# Altium schematic sheet 02.SchDoc
size A4
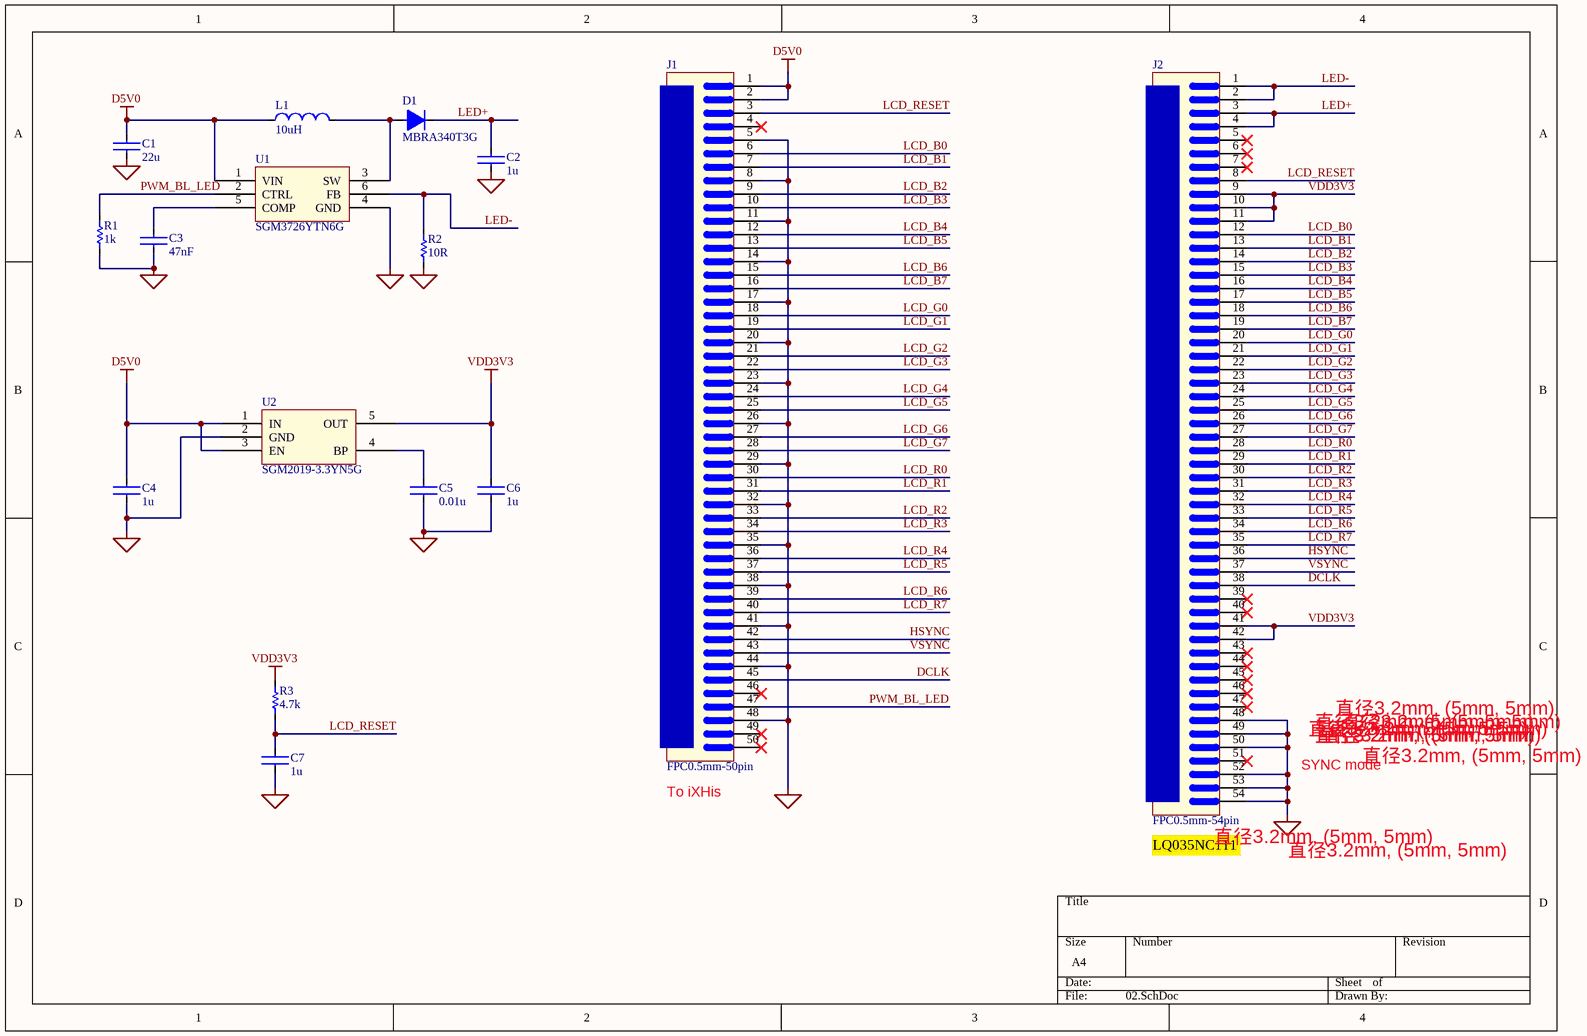
[diagram p0: 02.SchDoc]

## Parts
C1  22u  [CAPC1608X09N_C0603]
C2  1u  [CAPC2012X14N_C0805]
C3  47nF  [CAPC1608X09N_C0603]
C4  1u  [CAPC1608X09N_C0603]
C5  0.01u  [CAPC1608X09N_C0603]
C6  1u  [CAPC1608X09N_C0603]
C7  1u  [CAPC1608X09N_C0603]
D1  MBRA340T3G  [DIOM4326X23N_SMA]
J1  FPC0.5mm-50pin  [FPC0.5mm-50pin]
J2  FPC0.5mm-54pin  [FPC0.5mm-54pin]
L1  10uH  [NRS3015T100MNGH]
R1  1k  [RESC1608X05N_R0603]
R2  10R  [R0805]
R3  4.7k  [RESC1608X05N_R0603]
U1  SGM3726YTN6G  [TSOT23-6_SGM3726]
U2  SGM2019-3.3YN5G  [SOT95P280X125-5N_SGM2019]

## Nets
D5V0: C1.1 C4.1 J1.1 J1.2 L1.2 U1.1(VIN) U2.1(IN) U2.3(EN)
GND: C1.2 C2.2 C3.2 C4.2 C5.2 C6.2 C7.2 J1.5 J1.8 J1.11 J1.14 J1.17 J1.20 J1.23 J1.26 J1.29 J1.32 J1.35 J1.38 J1.41 J1.44 J1.48 J2.48 J2.49 J2.50 J2.52 J2.53 J2.54 R1.1 R2.1 U1.4(GND) U2.2(GND)
VDD3V3: C6.1 J2.9 J2.10 J2.11 J2.41 J2.42 R3.2 U2.5(OUT)
DCLK: J1.45 J2.38
HSYNC: J1.42 J2.36
LCD_B0: J1.6 J2.12
LCD_B1: J1.7 J2.13
LCD_B2: J1.9 J2.14
LCD_B3: J1.10 J2.15
LCD_B4: J1.12 J2.16
LCD_B5: J1.13 J2.17
LCD_B6: J1.15 J2.18
LCD_B7: J1.16 J2.19
LCD_G0: J1.18 J2.20
LCD_G1: J1.19 J2.21
LCD_G2: J1.21 J2.22
LCD_G3: J1.22 J2.23
LCD_G4: J1.24 J2.24
LCD_G5: J1.25 J2.25
LCD_G6: J1.27 J2.26
LCD_G7: J1.28 J2.27
LCD_R0: J1.30 J2.28
LCD_R1: J1.31 J2.29
LCD_R2: J1.33 J2.30
LCD_R3: J1.34 J2.31
LCD_R4: J1.36 J2.32
LCD_R5: J1.37 J2.33
LCD_R6: J1.39 J2.34
LCD_R7: J1.40 J2.35
LCD_RESET: C7.1 J1.3 J2.8 R3.1
LED+: C2.1 D1.2(K) J2.3 J2.4
LED-: J2.1 J2.2 R2.2 U1.6(FB)
PWM_BL_LED: J1.47 R1.2 U1.2(CTRL)
VSYNC: J1.43 J2.37
NetC3_1: C3.1 U1.5(COMP)
NetC5_1: C5.1 U2.4(BP)
NetD1_1: D1.1(A) L1.1 U1.3(SW)

Not connected (* = marked no-connect by the designer): J1 4(3)* 46* 49* 50*; J2 5(4)* 6(5)* 7(6)* 39* 40* 43* 44* 45* 46* 47* 51*

## Notes on the sheet
- 直径3.2mm, (5mm, 5mm)
- SYNC mode
- (near J1) To iXHis
- (near J2) LQ035NC111
- (near J2) 直径3.2mm, (5mm, 5mm)

## Library data of the parts
C1 = CAP114: CAP,Ceramic,X7R,10%,6.3V,22uF,0603; Manufacturer1: *; Manufacturer2: *; PartNumberManufacturer1: *; UnitPrice: *; Value: 22u
C2 = CAP110: CAP,Ceramic,X7R,10%,25V,1uF,0805; Manufacturer1: *; Manufacturer2: *; PartNumberManufacturer1: *; UnitPrice: *; Value: 1u
C3 = CAP115: CAP,Ceramic,X7R,10%,50V,47nF,0603; Manufacturer1: *; Manufacturer2: *; PartNumberManufacturer1: *; UnitPrice: *; Value: 47nF
C4 C6 C7 = CAP12: CAP,Ceramic,X7R,10%,16V,1uF,0603; Manufacturer1: *; Manufacturer2: *; PartNumberManufacturer1: *; UnitPrice: *; Value: 1u
C5 = CAP112: CAP,Ceramic,X7R,10%,50V,0.01uF,0603; Manufacturer1: *; Manufacturer2: *; PartNumberManufacturer1: *; UnitPrice: *; Value: 0.01u
D1 = MBRA340T3G: Schottky Barrier Rectifier,40V,3A,SMA; Manufacturer1: ONsemi; Manufacturer2: Diodes; PartNumberManufacturer2: B340A-13-F; PartNumberManufacturer1: MBRA340T3G; UnitPrice: *
J1 = FPC0.5mm_04: FFC socket,50-Pin,top contact,0.5mm Pitch,SMD; Manufacturer1: TBD; Manufacturer2: *; PartNumberManufacturer1: FPC0.5mm-50pin; PartNumberManufacturer2: *; UnitPrice: *
J2 = FPC0.5mm_03: FFC socket,54-Pin,bottom contact,0.5mm Pitch,SMD; Manufacturer1: TBD; Manufacturer2: *; PartNumberManufacturer1: FPC0.5mm-54pin; PartNumberManufacturer2: *; UnitPrice: *
L1 = NRS3015T100MNGH: Inductor,10uH,700mA,0.22ohm,SMD; Manufacturer1: TAIYO YUDEN; Manufacturer2: *; PartNumberManufacturer2: *; PartNumberManufacturer1: NRS3015T100MNGH; UnitPrice: *; Value: 10uH
R1 = RES11: RES,1k,1%,1/10W,0603; PartNumberManufacturer2: *; Manufacturer2: *; PartNumberManufacturer1: *; UnitPrice: *; Manufacturer1: *; Value: 1k
R2 = RES113_2: RES,10R,1%,1/8W,0805; Manufacturer1: *; PartNumberManufacturer2: *; Manufacturer2: *; PartNumberManufacturer1: *; Value: 10R; UnitPrice: *
R3 = RES15: RES,4.7k,1%,1/10W,0603; Manufacturer1: *; PartNumberManufacturer2: *; Manufacturer2: *; PartNumberManufacturer1: *; Value: 4.7k; UnitPrice: *
U1 = SGM3726YTN6G: IC, boost converter, 1.1A, TSOT23-6; Manufacturer1: SGM; PartNumberManufacturer1: SGM3726YTN6G; Manufacturer2: *; PartNumberManufacturer2: *; UnitPrice: *
U2 = SGM2019-3.3: IC,LDO 3.3V@300mA,SOT23-5; Manufacturer1: SGM; PartNumberManufacturer1: SGM2019-3.3YN5G; Manufacturer2: *; PartNumberManufacturer2: *; UnitPrice: *